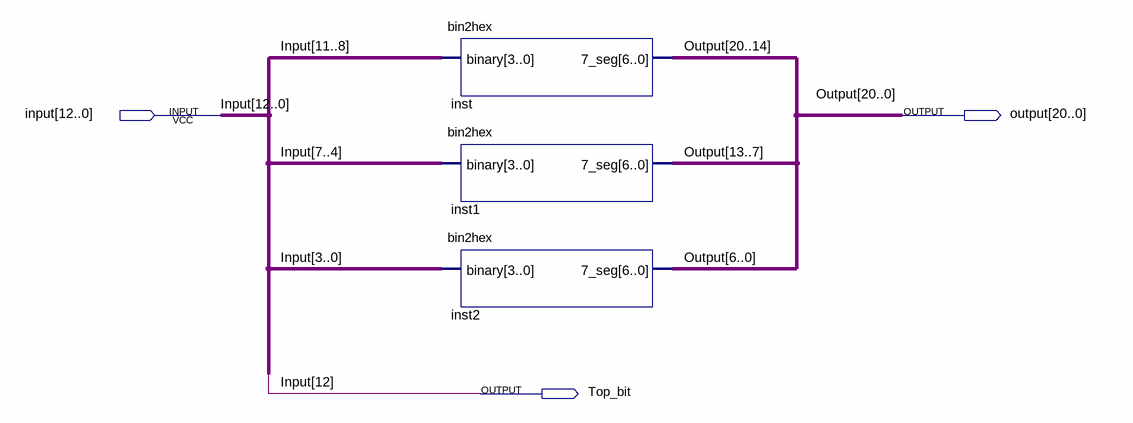
[diagram p0: schematic sheet]
// Quartus schematic Display3.bdf as structural Verilog: 3 symbols, 3 pins
module Display3 (
  input  [12:0] \input ,
  output [20:0] \output ,
  output Top_bit
);

  bin2hex inst (.binary(\input [11:8]), .\7_seg (\output [20:14]));
  bin2hex inst1 (.binary(\input [7:4]), .\7_seg (\output [13:7]));
  bin2hex inst2 (.binary(\input [3:0]), .\7_seg (\output [6:0]));

  assign Top_bit = \input [12];
endmodule
